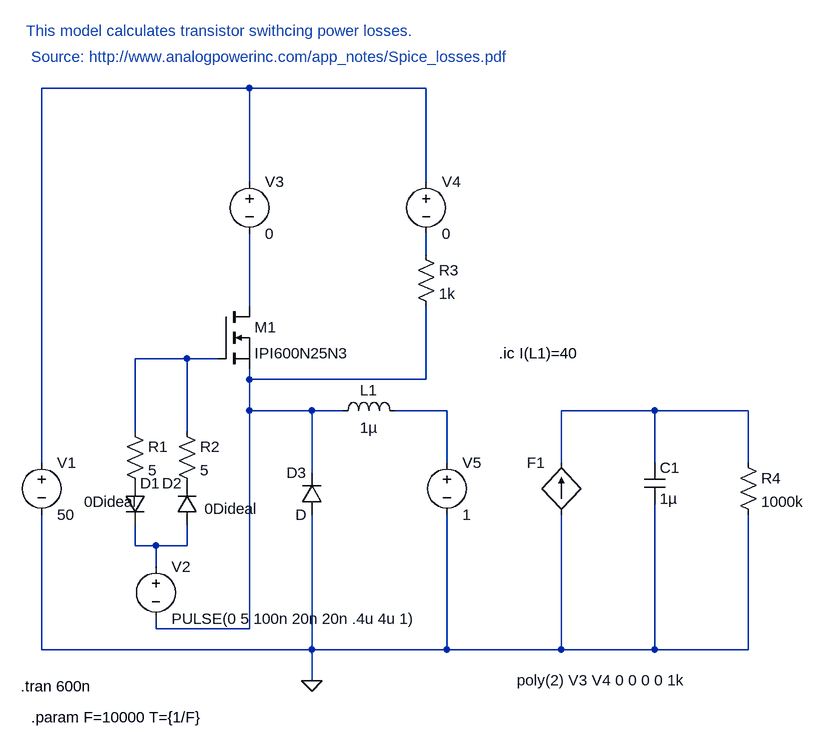
[diagram p0: schematic Transistor_switching_losses_simulation_001.asc]
Transistor_switching_losses_simulation_001.asc, the LTspice schematic file:
Version 4
SHEET 1 1212 680
WIRE 352 -432 32 -432
WIRE 624 -432 352 -432
WIRE 352 -288 352 -432
WIRE 624 -288 624 -432
WIRE 624 -176 624 -208
WIRE 352 -96 352 -208
WIRE 256 -16 176 -16
WIRE 304 -16 256 -16
WIRE 352 16 352 0
WIRE 624 16 624 -96
WIRE 624 16 352 16
WIRE 352 64 352 16
WIRE 448 64 352 64
WIRE 496 64 448 64
WIRE 656 64 576 64
WIRE 976 64 832 64
WIRE 1120 64 976 64
WIRE 176 96 176 -16
WIRE 256 96 256 -16
WIRE 32 144 32 -432
WIRE 656 144 656 64
WIRE 832 144 832 64
WIRE 976 144 976 64
WIRE 1120 144 1120 64
WIRE 448 160 448 64
WIRE 176 272 176 240
WIRE 208 272 176 272
WIRE 256 272 256 240
WIRE 256 272 208 272
WIRE 208 304 208 272
WIRE 208 400 208 384
WIRE 352 400 352 64
WIRE 352 400 208 400
WIRE 32 432 32 224
WIRE 448 432 448 224
WIRE 448 432 32 432
WIRE 656 432 656 224
WIRE 656 432 448 432
WIRE 832 432 832 224
WIRE 832 432 656 432
WIRE 976 432 976 208
WIRE 976 432 832 432
WIRE 1120 432 1120 224
WIRE 1120 432 976 432
WIRE 448 480 448 432
FLAG 448 480 0
SYMBOL voltage 32 128 R0
WINDOW 123 0 0 Left 2
WINDOW 39 0 0 Left 2
SYMATTR InstName V1
SYMATTR Value 50
SYMBOL voltage 208 288 R0
SYMATTR InstName V2
SYMATTR Value PULSE(0 5 100n 20n 20n .4u 4u 1)
SYMBOL voltage 352 -304 R0
WINDOW 123 0 0 Left 2
WINDOW 39 0 0 Left 2
SYMATTR InstName V3
SYMATTR Value 0
SYMBOL voltage 624 -304 R0
WINDOW 123 0 0 Left 2
WINDOW 39 0 0 Left 2
SYMATTR InstName V4
SYMATTR Value 0
SYMBOL diode 160 176 R0
WINDOW 3 123 39 Left 2
SYMATTR Value 0Dideal
SYMATTR InstName D1
SYMBOL diode 272 240 R180
WINDOW 0 24 64 Left 2
WINDOW 3 93 36 Left 2
SYMATTR InstName D2
SYMATTR Value 0Dideal
SYMBOL res 160 80 R0
SYMATTR InstName R1
SYMATTR Value 5
SYMBOL res 240 80 R0
SYMATTR InstName R2
SYMATTR Value 5
SYMBOL nmos 304 -96 R0
SYMATTR InstName M1
SYMATTR Value IPI600N25N3
SYMBOL diode 464 224 R180
WINDOW 0 24 64 Left 2
WINDOW 3 24 0 Left 2
SYMATTR InstName D3
SYMBOL ind 480 80 R270
WINDOW 0 32 56 VTop 2
WINDOW 3 5 56 VBottom 2
SYMATTR InstName L1
SYMATTR Value 1µ
SYMATTR SpiceLine Rser=1
SYMBOL voltage 656 128 R0
WINDOW 123 0 0 Left 2
WINDOW 39 0 0 Left 2
SYMATTR InstName V5
SYMATTR Value 1
SYMBOL res 608 -192 R0
SYMATTR InstName R3
SYMATTR Value 1k
SYMBOL f 832 224 R180
WINDOW 0 24 80 Left 2
WINDOW 3 68 -255 Right 2
SYMATTR InstName F1
SYMATTR Value poly(2) V3 V4 0 0 0 0 1k
SYMBOL cap 960 144 R0
SYMATTR InstName C1
SYMATTR Value 1µ
SYMBOL res 1104 128 R0
SYMATTR InstName R4
SYMATTR Value 1000k
TEXT 0 488 Left 2 !.tran 600n
TEXT 736 -24 Left 2 !.ic I(L1)=40
TEXT 16 536 Left 2 !.param F=10000 T={1/F}
TEXT 8 -520 Left 2 ;This model calculates transistor swithcing power losses.
TEXT 16 -480 Left 2 ;Source: http://www.analogpowerinc.com/app_notes/Spice_losses.pdf

The netlist it stands for:
* Transistor_switching_losses_simulation_001.asc
V1 N001 0 50
V2 N008 N005 PULSE(0 5 100n 20n 20n .4u 4u 1)
V3 N001 N003 0
V4 N001 N002 0
D1 P001 N008 0Dideal
D2 N008 P002 0Dideal
R1 N004 P001 5
R2 N004 P002 5
M1 N003 N004 N005 N005 IPI600N25N3
D3 0 N005 D
L1 N005 N006 1µ Rser=1
V5 N006 0 1
R3 N002 N005 1k
F1 0 N007 poly(2) V3 V4 0 0 0 0 1k
C1 N007 0 1µ
R4 N007 0 1000k
.model D D
.lib standard.dio
.model NMOS NMOS
.model PMOS PMOS
.lib standard.mos
.tran 600n
.ic I(L1)=40
.param F=10000 T={1/F}
* This model calculates transistor swithcing power losses.
* Source: http://www.analogpowerinc.com/app_notes/Spice_losses.pdf
.backanno
.end